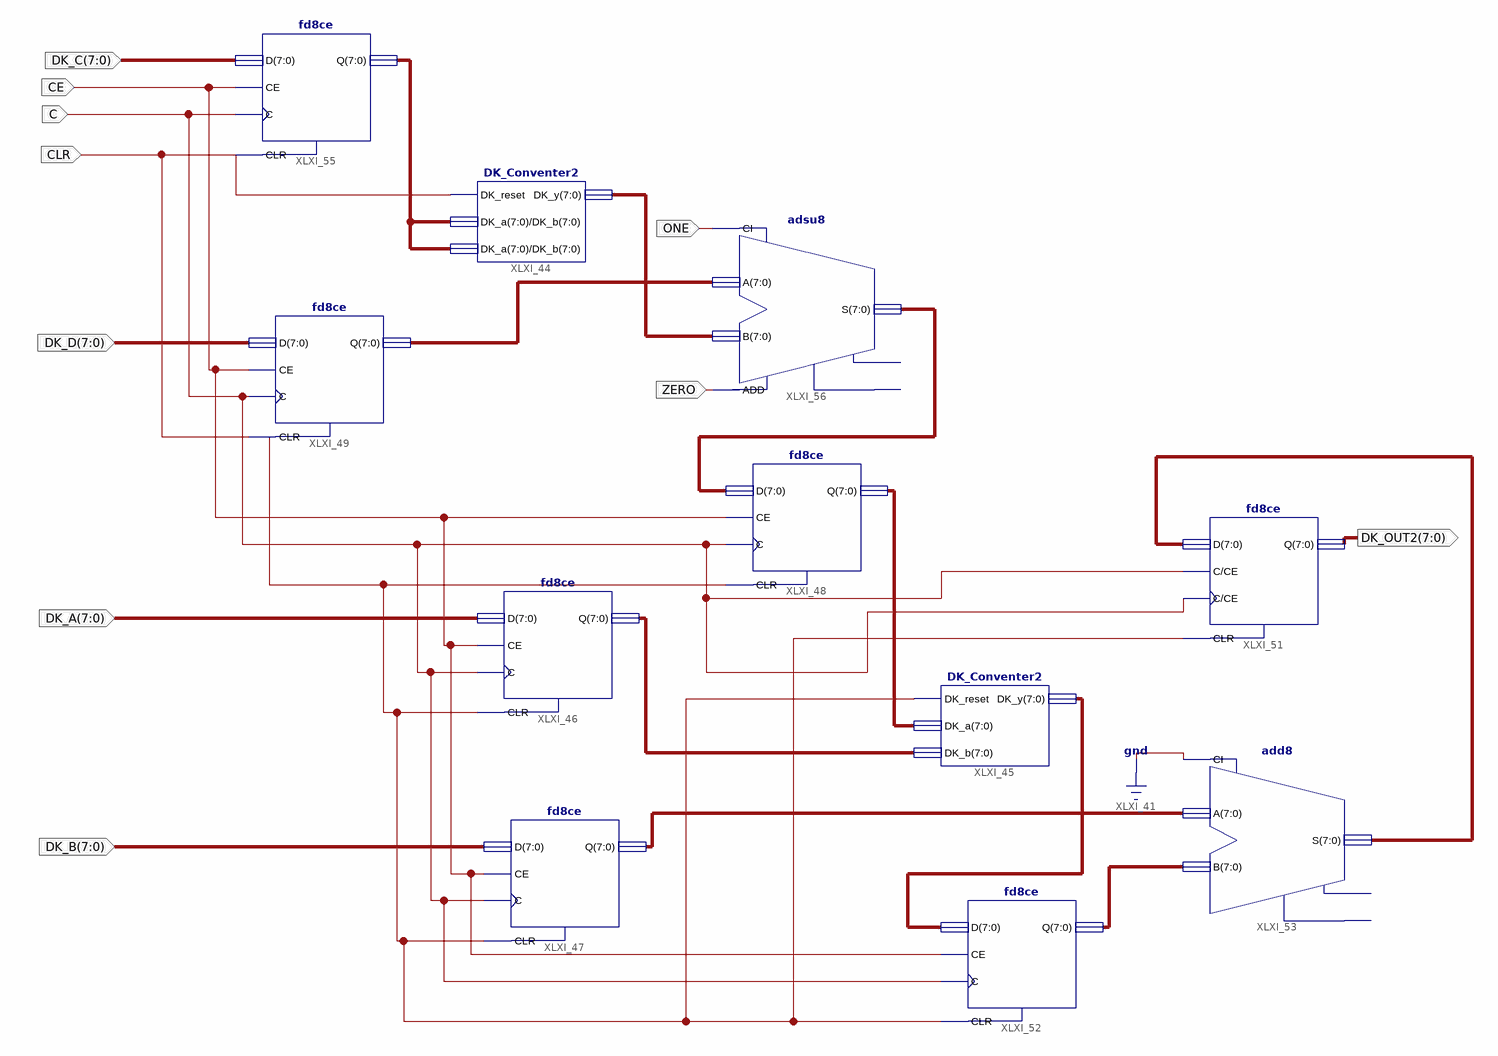
[diagram p0: schematic sheet 1]
// Xilinx ISE schematic schematic_Vers3.sch (virtex7) as structural Verilog: 11 symbols, 10 ports
module schematic_Vers3 (
  input  CE,
  input  [7:0] DK_C,
  input  ZERO,
  input  ONE,
  input  [7:0] DK_A,
  input  [7:0] DK_B,
  input  C,
  input  [7:0] DK_D,
  input  CLR,
  output [7:0] DK_OUT2
);

  wire [7:0] DK_OUT, XLXN_49, XLXN_71, XLXN_72, XLXN_74, XLXN_85, XLXN_89, XLXN_116, XLXN_117, XLXN_124;

  DK_Conventer2 XLXI_44 (.DK_reset(CLR), .DK_a(XLXN_49), .DK_b(XLXN_49), .DK_y(XLXN_71));
  fd8ce XLXI_46 (.C(C), .CE(CE), .CLR(CLR), .D(DK_A), .Q(XLXN_85));
  fd8ce XLXI_47 (.C(C), .CE(CE), .CLR(CLR), .D(DK_B), .Q(XLXN_116));
  fd8ce XLXI_48 (.C(C), .CE(CE), .CLR(CLR), .D(XLXN_74), .Q(XLXN_89));
  fd8ce XLXI_49 (.C(C), .CE(CE), .CLR(CLR), .D(DK_D), .Q(XLXN_72));
  fd8ce XLXI_51 (.C(C), .CE(C), .CLR(CLR), .D(XLXN_124), .Q(DK_OUT2));
  fd8ce XLXI_52 (.C(C), .CE(CE), .CLR(CLR), .D(DK_OUT), .Q(XLXN_117));
  add8 XLXI_53 (.A(XLXN_116), .B(XLXN_117), .CI(1'b0), .S(XLXN_124));  // open: CO, OFL
  adsu8 XLXI_56 (.A(XLXN_72), .ADD(ZERO), .B(XLXN_71), .CI(ONE), .S(XLXN_74));  // open: CO, OFL
  DK_Conventer2 XLXI_45 (.DK_reset(CLR), .DK_a(XLXN_89), .DK_b(XLXN_85), .DK_y(DK_OUT));
  fd8ce XLXI_55 (.C(C), .CE(CE), .CLR(CLR), .D(DK_C), .Q(XLXN_49));
endmodule
